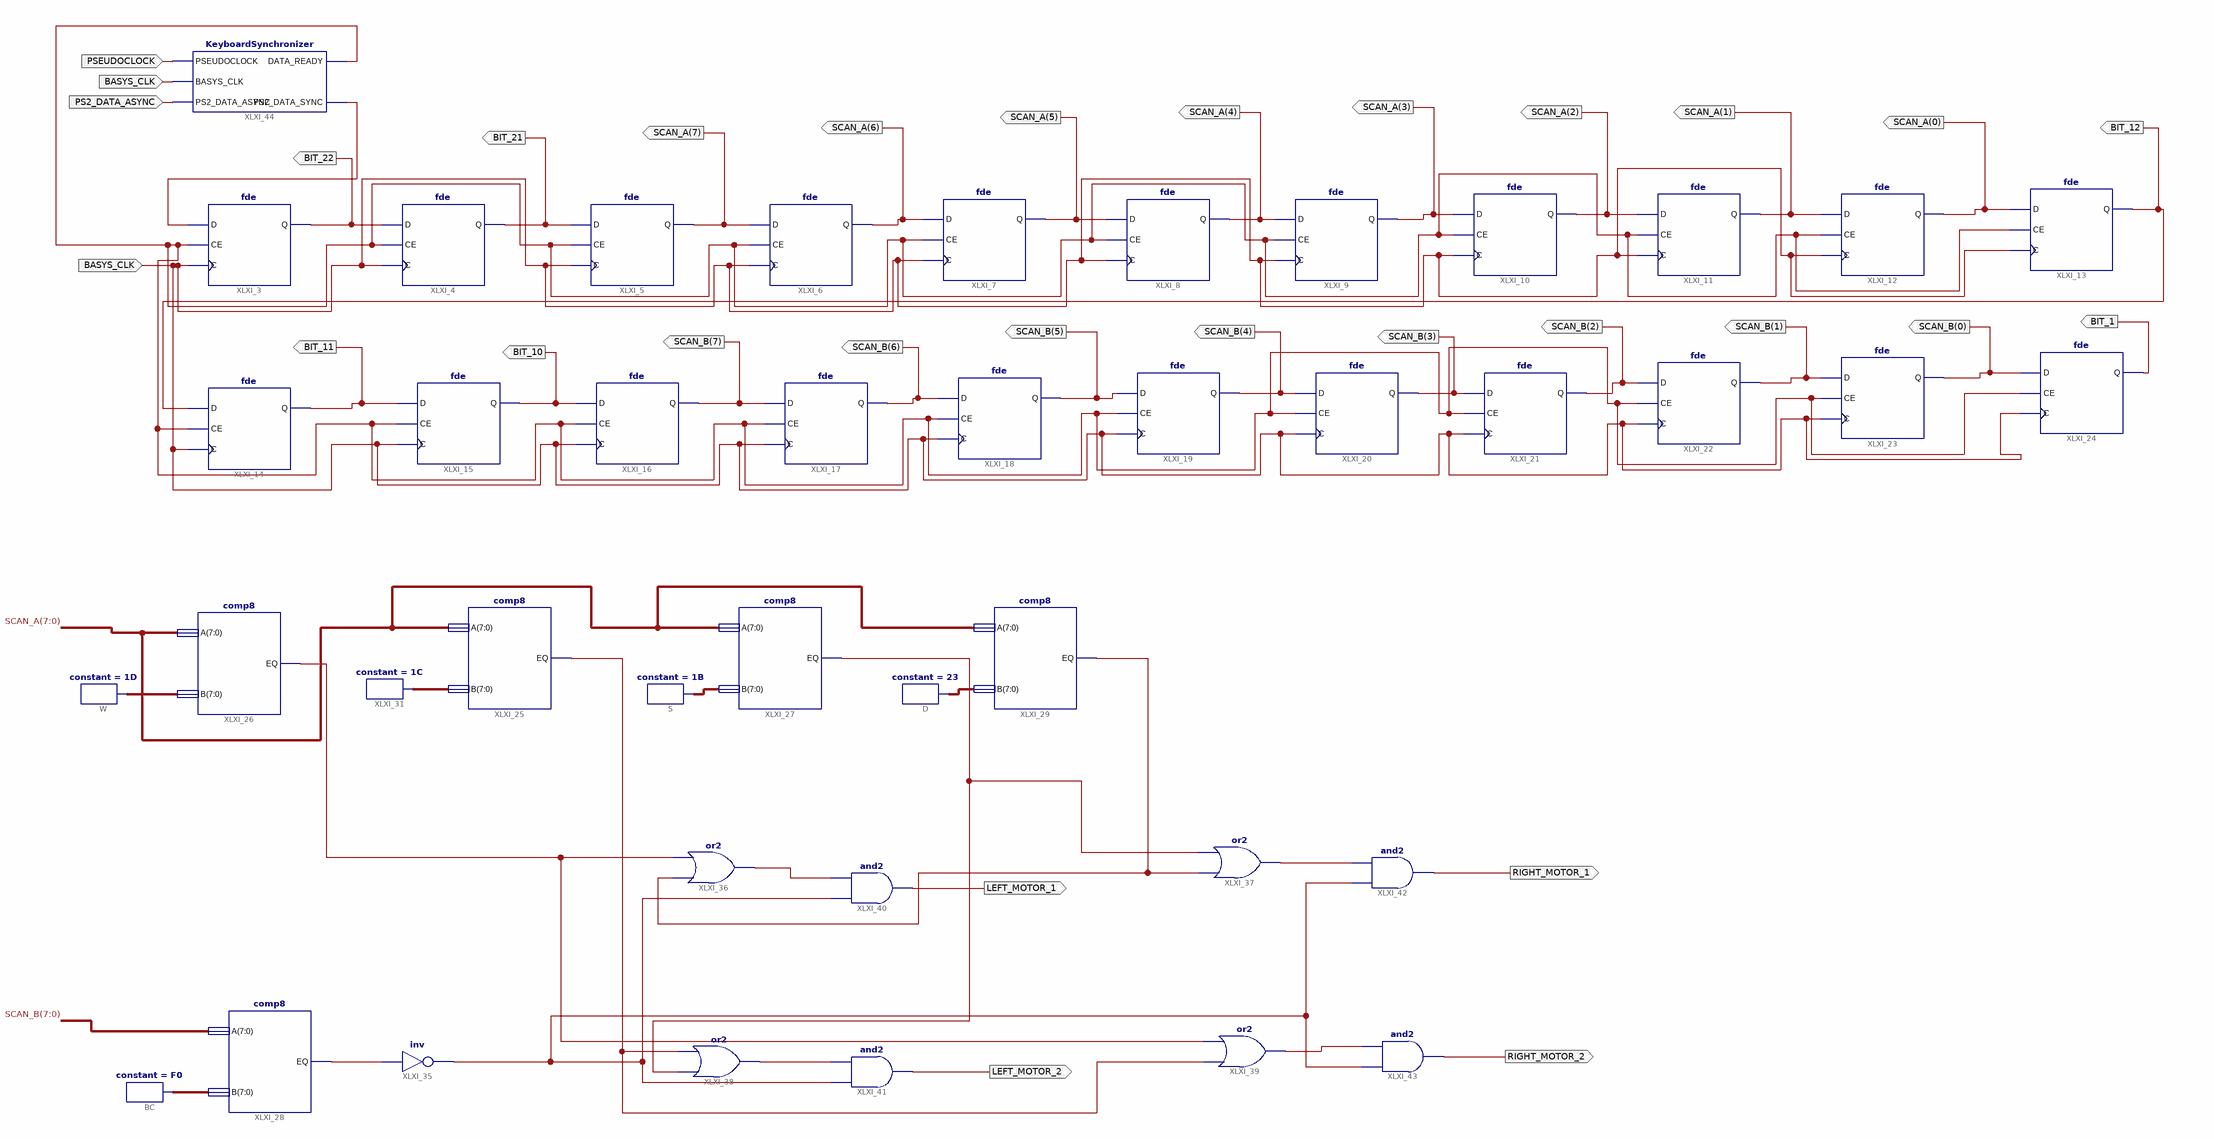
[diagram p0: schematic sheet 1]
// Xilinx ISE schematic Schematic1.sch (spartan3e) as structural Verilog: 42 symbols, 29 ports
module Schematic1 (
  input  BASYS_CLK,
  input  PSEUDOCLOCK,
  input  PS2_DATA_ASYNC,
  output BIT_22,
  output BIT_21,
  output [7:0] SCAN_A,
  output BIT_11,
  output BIT_10,
  output [7:0] SCAN_B,
  output BIT_12,
  output BIT_1,
  output RIGHT_MOTOR_2,
  output RIGHT_MOTOR_1,
  output LEFT_MOTOR_1,
  output LEFT_MOTOR_2
);

  wire DATA_READY, XLXN_29, XLXN_42, XLXN_43, XLXN_44, XLXN_45, XLXN_46, XLXN_53, XLXN_54, XLXN_55, XLXN_57,
       XLXN_61;
  wire [7:0] XLXN_35, XLXN_36, XLXN_37, XLXN_38, XLXN_41;

  fde XLXI_3 (.C(BASYS_CLK), .CE(DATA_READY), .D(XLXN_29), .Q(BIT_22));
  fde XLXI_4 (.C(BASYS_CLK), .CE(DATA_READY), .D(BIT_22), .Q(BIT_21));
  fde XLXI_5 (.C(BASYS_CLK), .CE(DATA_READY), .D(BIT_21), .Q(SCAN_A[7]));
  fde XLXI_6 (.C(BASYS_CLK), .CE(DATA_READY), .D(SCAN_A[7]), .Q(SCAN_A[6]));
  fde XLXI_7 (.C(BASYS_CLK), .CE(DATA_READY), .D(SCAN_A[6]), .Q(SCAN_A[5]));
  fde XLXI_8 (.C(BASYS_CLK), .CE(DATA_READY), .D(SCAN_A[5]), .Q(SCAN_A[4]));
  fde XLXI_9 (.C(BASYS_CLK), .CE(DATA_READY), .D(SCAN_A[4]), .Q(SCAN_A[3]));
  fde XLXI_10 (.C(BASYS_CLK), .CE(DATA_READY), .D(SCAN_A[3]), .Q(SCAN_A[2]));
  fde XLXI_11 (.C(BASYS_CLK), .CE(DATA_READY), .D(SCAN_A[2]), .Q(SCAN_A[1]));
  fde XLXI_12 (.C(BASYS_CLK), .CE(DATA_READY), .D(SCAN_A[1]), .Q(SCAN_A[0]));
  fde XLXI_13 (.C(BASYS_CLK), .CE(DATA_READY), .D(SCAN_A[0]), .Q(BIT_12));
  fde XLXI_14 (.C(BASYS_CLK), .CE(DATA_READY), .D(BIT_12), .Q(BIT_11));
  fde XLXI_15 (.C(BASYS_CLK), .CE(DATA_READY), .D(BIT_11), .Q(BIT_10));
  fde XLXI_16 (.C(BASYS_CLK), .CE(DATA_READY), .D(BIT_10), .Q(SCAN_B[7]));
  fde XLXI_17 (.C(BASYS_CLK), .CE(DATA_READY), .D(SCAN_B[7]), .Q(SCAN_B[6]));
  fde XLXI_18 (.C(BASYS_CLK), .CE(DATA_READY), .D(SCAN_B[6]), .Q(SCAN_B[5]));
  fde XLXI_19 (.C(BASYS_CLK), .CE(DATA_READY), .D(SCAN_B[5]), .Q(SCAN_B[4]));
  fde XLXI_20 (.C(BASYS_CLK), .CE(DATA_READY), .D(SCAN_B[4]), .Q(SCAN_B[3]));
  fde XLXI_21 (.C(BASYS_CLK), .CE(DATA_READY), .D(SCAN_B[3]), .Q(SCAN_B[2]));
  fde XLXI_22 (.C(BASYS_CLK), .CE(DATA_READY), .D(SCAN_B[2]), .Q(SCAN_B[1]));
  fde XLXI_23 (.C(BASYS_CLK), .CE(DATA_READY), .D(SCAN_B[1]), .Q(SCAN_B[0]));
  fde XLXI_24 (.C(BASYS_CLK), .CE(DATA_READY), .D(SCAN_B[0]), .Q(BIT_1));
  comp8 XLXI_25 (.A(SCAN_A), .B(XLXN_36), .EQ(XLXN_54));
  comp8 XLXI_26 (.A(SCAN_A), .B(XLXN_35), .EQ(XLXN_53));
  comp8 XLXI_27 (.A(SCAN_A), .B(XLXN_37), .EQ(XLXN_55));
  comp8 XLXI_28 (.A(SCAN_B), .B(XLXN_41), .EQ(XLXN_42));
  comp8 XLXI_29 (.A(SCAN_A), .B(XLXN_38), .EQ(XLXN_57));
  constant #(.CValue("1D")) W (.O(XLXN_35));
  constant #(.CValue("1C")) XLXI_31 (.O(XLXN_36));
  constant #(.CValue("1B")) S (.O(XLXN_37));
  constant #(.CValue("23")) D (.O(XLXN_38));
  constant #(.CValue("F0")) BC (.O(XLXN_41));
  not XLXI_35 (XLXN_61, XLXN_42);
  or XLXI_36 (XLXN_44, XLXN_57, XLXN_53);
  or XLXI_37 (XLXN_45, XLXN_57, XLXN_55);
  or XLXI_38 (XLXN_43, XLXN_55, XLXN_54);
  or XLXI_39 (XLXN_46, XLXN_54, XLXN_53);
  and XLXI_40 (LEFT_MOTOR_1, XLXN_61, XLXN_44);
  and XLXI_41 (LEFT_MOTOR_2, XLXN_61, XLXN_43);
  and XLXI_42 (RIGHT_MOTOR_1, XLXN_61, XLXN_45);
  and XLXI_43 (RIGHT_MOTOR_2, XLXN_61, XLXN_46);
  KeyboardSynchronizer XLXI_44 (
    .PSEUDOCLOCK(PSEUDOCLOCK), .BASYS_CLK(BASYS_CLK), .PS2_DATA_ASYNC(PS2_DATA_ASYNC),
    .DATA_READY(DATA_READY), .PS2_DATA_SYNC(XLXN_29));

  // Notes on the sheet:
  //   LOC on signal BASYS_CLK = P89
  //   LOC on signal RIGHT_MOTOR_2 = P17
  //   LOC on signal RIGHT_MOTOR_1 = P16
  //   LOC on signal LEFT_MOTOR_1 = P91
  //   LOC on signal LEFT_MOTOR_2 = P92
  //   LOC on signal PSEUDOCLOCK = P11
  //   LOC on signal PS2_DATA_ASYNC = P10
endmodule
